# EAGLE design cnc-distributor (EAGLE 6.4)
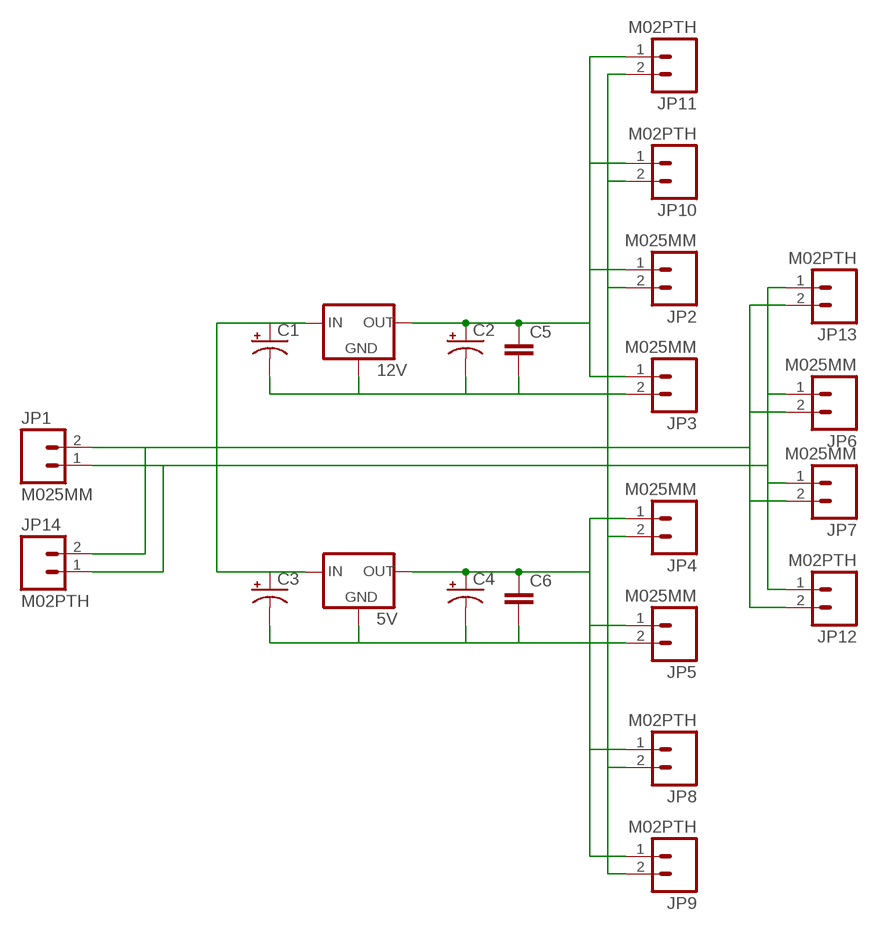
[diagram p0: schematic, sheet 1]

## Parts
5V  78XXS  [78XXS]
12V  78XXS  [78XXS]
C1  CAP_POLPTH2  [CPOL-RADIAL-10UF-25V]
C2  CAP_POLPTH2  [CPOL-RADIAL-10UF-25V]
C3  CAP_POLPTH2  [CPOL-RADIAL-10UF-25V]
C4  CAP_POLPTH2  [CPOL-RADIAL-10UF-25V]
C5  CAPPTH2  [CAP-PTH-SMALL2]
C6  CAPPTH2  [CAP-PTH-SMALL2]
JP1  M025MM  [SCREWTERMINAL-5MM-2]
JP2  M025MM  [SCREWTERMINAL-5MM-2]
JP3  M025MM  [SCREWTERMINAL-5MM-2]
JP4  M025MM  [SCREWTERMINAL-5MM-2]
JP5  M025MM  [SCREWTERMINAL-5MM-2]
JP6  M025MM  [SCREWTERMINAL-5MM-2]
JP7  M025MM  [SCREWTERMINAL-5MM-2]
JP8  M02PTH  [1X02]
JP9  M02PTH  [1X02]
JP10  M02PTH  [1X02]
JP11  M02PTH  [1X02]
JP12  M02PTH  [1X02]
JP13  M02PTH  [1X02]
JP14  M02PTH  [1X02]

## Nets
5V: 12V.OUT C2.1(+) C5.1 JP2.1 JP3.1 JP10.1 JP11.1
12V: 5V.OUT C4.1(+) C6.1 JP4.1 JP5.1 JP8.1 JP9.1
24V: 5V.IN 12V.IN C1.1(+) C3.1(+) JP1.1 JP6.1 JP7.1 JP12.1 JP13.1 JP14.1
GND: 5V.GND 12V.GND C1.2(-) C2.2(-) C3.2(-) C4.2(-) C5.2 C6.2 JP1.2 JP2.2 JP3.2 JP4.2 JP5.2 JP6.2 JP7.2 JP8.2 JP9.2 JP10.2 JP11.2 JP12.2 JP13.2 JP14.2

## Library data of the parts
5V 12V = v-reg:78XXS: VOLTAGE REGULATOR
C1-C4 = SparkFun-Passives:CAP_POL: Capacitor Polarized These are standard SMD and PTH capacitors. Normally 10uF, 47uF, and 100uF in electrolytic and tantalum varieties. Always verify the external diameter of the through hole cap, it varies with capacity, voltage, and manufacturer. The EIA devices should be standard.
C5 C6 = SparkFun-Capacitors:CAP: Capacitor Standard 0603 ceramic capacitor, and 0.1" leaded capacitor.
JP1-JP14 = SparkFun-Connectors:M02: Standard 2-pin 0.1" header. Use with - straight break away headers ( PRT-00116) - right angle break away headers (PRT-00553) - swiss pins (PRT-00743) - machine pins (PRT-00117) - female headers (PRT-00115) Molex polarized connector foot print use with: PRT-08233 with associated crimp pins and housings. 2.54_SCREWTERM for use with PRT-10571. 3.5mm Screw Terminal footprints for PRT-08084 5mm Screw Terminal footprints for use with PRT-08433

## Board
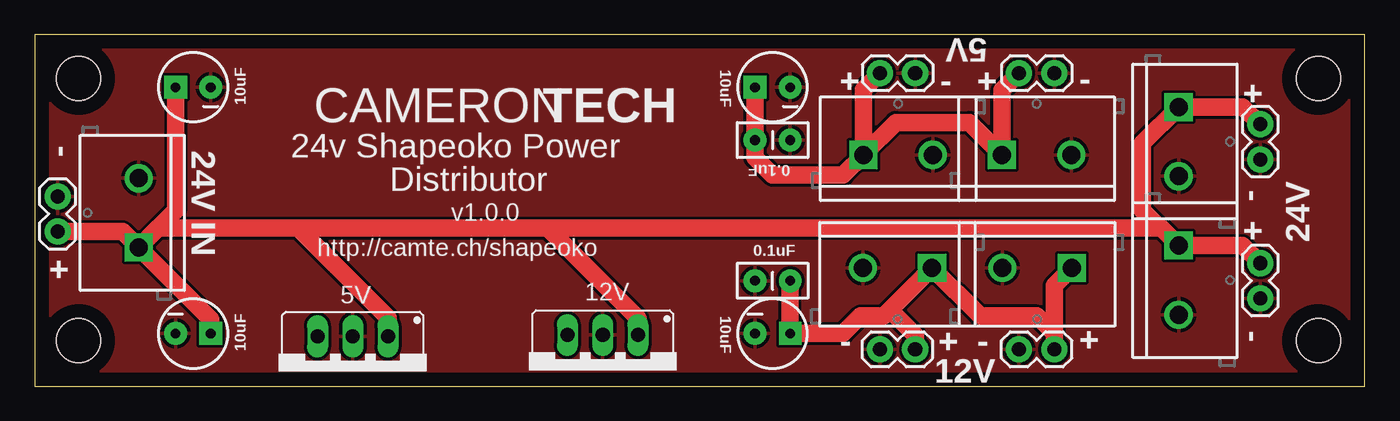
[diagram p1: board, top side]
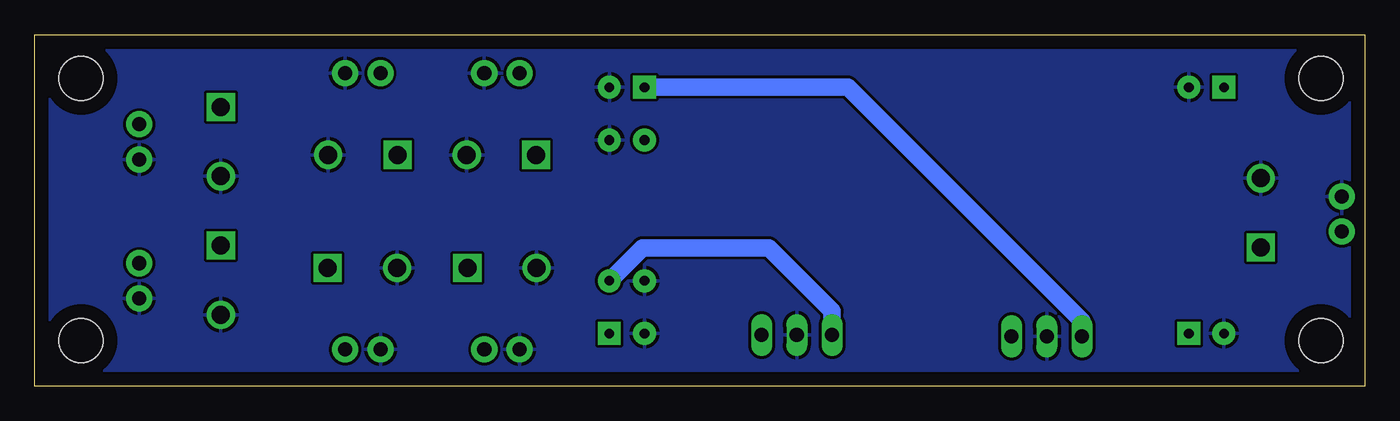
[diagram p2: board, bottom side, seen from below]

Size 95.95 x 25.39 mm. Coordinates in mm from the lower left corner, seen from the top.
Outline: 0,0 95.95,0 95.95,25.39 0,25.39 0,0
Copper layers (1*16): Top 0.035mm / dielectric 1.5mm / Bottom 0.035mm
Design rules "default": minimum track width 10mil, minimum drill 24mil, track to track 8mil, track to pad 8mil, pad to pad 8mil, via to via 8mil, smd to smd 8mil, copper to edge 40mil, drill to drill 8mil, minimum pad ring 10mil, minimum via ring 8mil, stop-mask expansion 4mil, vias tented up to drill 0mil, thermal gap 10mil
Holes 3.17 mm at 3.17,22.23 3.17,3.3 92.6,3.3 92.6,22.23

### Footprints (pad centres in the part's own frame; a part is rotated, then mirrored left to right if it is on the bottom)
78XXS = drill 1.016 long: GND 0,-2.54; IN -2.54,-2.54; OUT 2.54,-2.54
CPOL-RADIAL-10UF-25V = drill 0.7 pad 1.651 square: 1 1.27,0 | drill 0.7 pad 1.651: 2 -1.27,0
CAP-PTH-SMALL2 = drill 0.7 pad 1.651: 1 0,0; 2 2.54,0
SCREWTERMINAL-5MM-2 = drill 1.3 pad 2.032 square: 1 0,0 | drill 1.3 pad 2.032: 2 5,0
1X02 = drill 1.016 pad 1.88: 1 0,0; 2 2.54,0

### Placement (x,y rotation side)
5V  22.95,1.07 180 top
12V  40.98,1.17 180 top
C1  11.43,3.81 0 top
C2  53.23,3.81 0 top
C3  11.43,21.59 180 top
C4  53.23,21.59 180 top
C5  54.5,7.62 180 top
C6  51.96,17.78 0 top
JP1  7.5,10.02 90 top
JP2  64.74,8.54 180 top
JP3  74.81,8.54 180 top
JP4  69.78,16.71 0 top
JP5  59.78,16.71 0 top
JP6  82.52,20.16 270 top
JP7  82.52,10.17 270 top
JP8  60.98,22.61 0 top
JP9  71.01,22.61 0 top
JP10  73.55,2.67 180 top
JP11  63.52,2.67 180 top
JP12  88.41,8.89 270 top
JP13  88.41,18.92 270 top
JP14  1.65,11.18 90 top

### Tracks (layer width: path | path; a pad name or v marks a point on that pad's centre or on a via)
5V
  Top 1.27: C5.1 C2.1 58.31,3.81 59.58,5.08 61.28,5.08 61.7,5.5 | 61.7,5.5 JP2.1 68.2,5.08 72.28,5.08 73.55,3.81 JP10.1 73.55,7.28 JP3.1 | JP11.1 63.52,3.68 61.7,5.5
  Bottom 1.27: 12V.OUT 38.44,5.44 43,10 52.12,10 C5.1
12V
  Top 1.27: C4.1 C6.1 51.96,16.51 53.23,15.24 58.31,15.24 JP5.1 | JP5.1 59.78,21.41 JP8.1 | JP5.1 62.12,19.05 67.44,19.05 JP4.1 69.78,21.38 JP9.1
  Bottom 1.27: 5V.OUT 20.41,4.71 37.3,21.6 C4.1
24V
  Top 1.27: JP14.1 6.35,11.18 JP1.1 | JP13.1 87.17,20.16 JP6.1 79.9,17.54 79.9,12.7 81.17,11.43 | JP1.1 7.5,10.04 8.89,11.43 19,11.43 | 19,11.43 37,11.43 | 37,11.43 81.17,11.43 | C1.1 12.7,4.82 JP1.1 | C3.1 10.16,12.68 JP1.1 | JP12.1 87.13,10.17 JP7.1 81.26,11.43 81.17,11.43 | 5V.IN 25.49,4.94 19,11.43 | 12V.IN 43.52,4.91 37,11.43
GND
  pour Top: -1.27,26.67 -1.27,-1.27 98.08,-2.4 98.08,26.54
  pour Bottom: -1.27,26.67 97.68,26.67 97.68,-1.27 -1.27,-1.27

### Text on the board
tPlace: 10uF | 10uF | CAMERON | TECH | 24v Shapeoko Power | 0.1uF | Distributor | v1.0.0 | http://camte.ch/shapeoko | 0.1uF | 10uF | 10uF
tNames: 5V | + | - | + | - | + | - | 24V IN | - | + | 24V | + | + | - | - | + | - | 12V